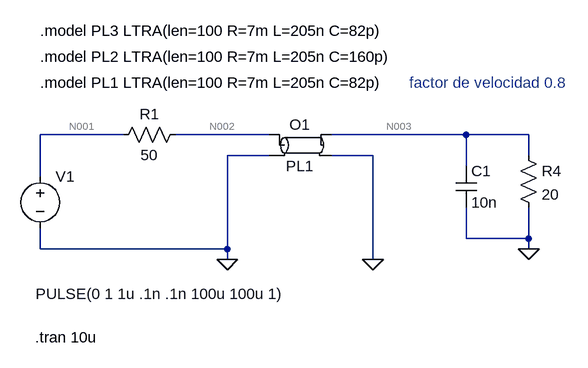
[diagram p0: schematic reflectometriaasc.asc]
reflectometriaasc.asc, the LTspice schematic file:
Version 4
SHEET 1 1240 680
WIRE 64 112 -64 112
WIRE 288 112 144 112
WIRE 592 112 384 112
WIRE 688 112 592 112
WIRE 288 144 224 144
WIRE 448 144 384 144
WIRE 688 144 688 112
WIRE 592 160 592 112
WIRE -64 176 -64 112
WIRE 592 272 592 224
WIRE 688 272 688 224
WIRE 688 272 592 272
WIRE -64 288 -64 256
WIRE 224 288 224 144
WIRE 224 288 -64 288
WIRE 688 288 688 272
WIRE 224 304 224 288
WIRE 448 304 448 144
FLAG 224 304 0
FLAG 448 304 0
FLAG 688 288 0
SYMBOL voltage -64 160 R0
WINDOW 123 0 0 Left 2
WINDOW 39 -1 231 Left 2
WINDOW 3 -7 197 Left 2
SYMATTR Value PULSE(0 1 1u .1n .1n 100u 100u 1)
SYMATTR InstName V1
SYMBOL ltline 336 128 R0
SYMATTR InstName O1
SYMATTR Value PL1
SYMBOL res 672 128 R0
SYMATTR InstName R4
SYMATTR Value 20
SYMBOL res 48 128 R270
WINDOW 0 32 56 VTop 2
WINDOW 3 0 56 VBottom 2
SYMATTR InstName R1
SYMATTR Value 50
SYMBOL cap 576 160 R0
SYMATTR InstName C1
SYMATTR Value 10n
TEXT -72 424 Left 2 !.tran 10u
TEXT -64 32 Left 2 !.model PL1 LTRA(len=100 R=7m L=205n C=82p)
TEXT 504 32 Left 2 ;factor de velocidad 0.8
TEXT -64 -8 Left 2 !.model PL2 LTRA(len=100 R=7m L=205n C=160p)
TEXT -64 -48 Left 2 !.model PL3 LTRA(len=100 R=7m L=205n C=82p)

The netlist it stands for:
* reflectometriaasc.asc
V1 N001 0 PULSE(0 1 1u .1n .1n 100u 100u 1)
O1 N002 0 N003 0 PL1
R4 N003 0 20
R1 N001 N002 50
C1 N003 0 10n
.tran 10u
.model PL1 LTRA(len=100 R=7m L=205n C=82p)
* factor de velocidad 0.8
.model PL2 LTRA(len=100 R=7m L=205n C=160p)
.model PL3 LTRA(len=100 R=7m L=205n C=82p)
.backanno
.end

* Results of the author's LTspice run, read from the files saved beside the schematic
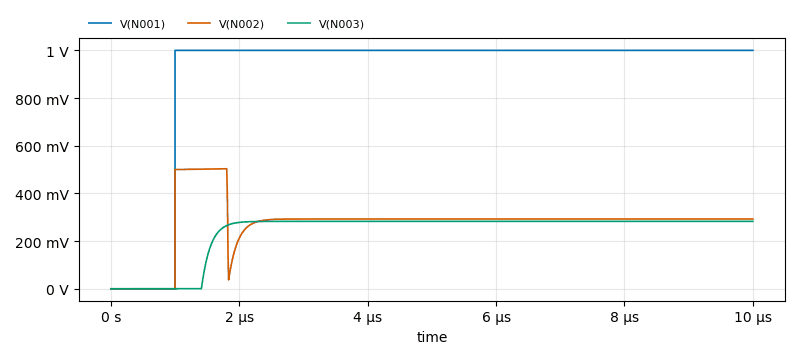
[diagram p1: Transient Analysis of reflectometriaasc.asc, plotted from the saved traces]
* Transient Analysis, 1 run:
*   V(N001): min 0 V, max 1 V, average 900 mV, rms 948.7 mV, last 1 V
*   V(N002): min 0 V, max 503.4 mV, average 276.6 mV, rms 298.1 mV, last 292.8 mV
*   V(N003): min 0 V, max 282.9 mV, average 239 mV, rms 258.9 mV, last 282.9 mV